# Altium schematic sheet CE842170260_SHEET5.SchDoc
size Tabloid; SheetNumber: 4; SheetTotal: 4; PageSetup: Record=PageOptions|CenterHorizontal=True|CenterVertical=True|PrintScale=0.70|XCorrection=1.00|YCorrection=1.00|PrintKind=1|BorderSize=5000000|LeftOffset=0|BottomOffset=0|Orientation=2|PaperLength=1000|PaperWidth=1000|Scale=100|PaperSource=7|PrintQuality=-4|MediaType=1|DitherType=10|PaperKind=8 1/2x11|PrintScaleMode=1; SPICEModelCacheMIYJXAQF: <root> / <DocumentId>MIYJXAQF</DocumentId> / </root>
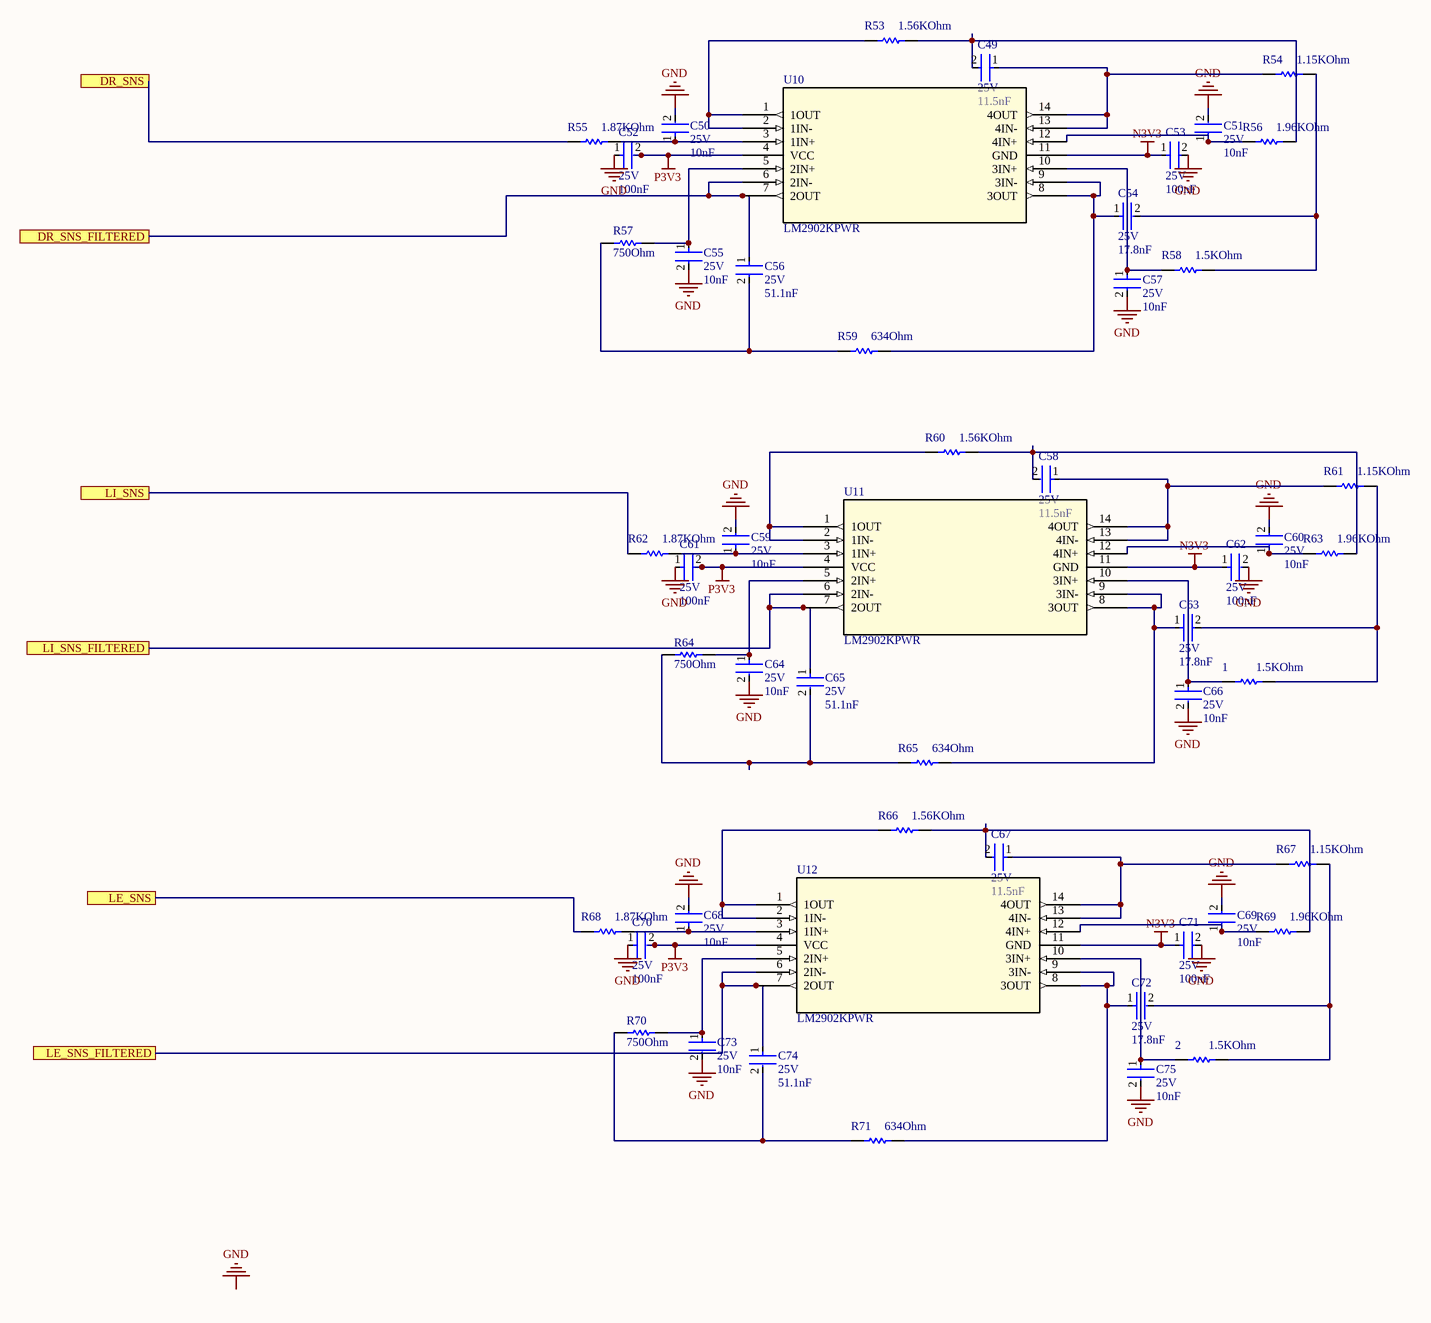
[diagram p0: CE842170260_SHEET5.SchDoc]

## Parts
1  Resistance: 1.5KOhm  [RESC1005X40X25LL05T05]  (hidden comment: ERJ2RKF1002X)
2  Resistance: 1.5KOhm  [RESC1005X40X25LL05T05]  (hidden comment: ERJ2RKF1002X)
C49  Voltage Rating (DC): 25V  Capacitance: 11.5nF  [FP-C1005-050-0_05-MFG]  (hidden comment: C1005X5R1E104K050BC)
C50  Voltage Rating (DC): 25V  Capacitance: 10nF  [FP-C1005-050-0_05-MFG]  (hidden comment: C1005X5R1E104K050BC)
C51  Voltage Rating (DC): 25V  Capacitance: 10nF  [FP-C1005-050-0_05-MFG]  (hidden comment: C1005X5R1E104K050BC)
C52  Voltage Rating (DC): 25V  Capacitance: 100nF  [FP-C1005-050-0_05-MFG]  (hidden comment: C1005X5R1E104K050BC)
C53  Voltage Rating (DC): 25V  Capacitance: 100nF  [FP-C1005-050-0_05-MFG]  (hidden comment: C1005X5R1E104K050BC)
C54  Voltage Rating (DC): 25V  Capacitance: 17.8nF  [FP-C1005-050-0_05-MFG]  (hidden comment: C1005X5R1E104K050BC)
C55  Voltage Rating (DC): 25V  Capacitance: 10nF  [FP-C1005-050-0_05-MFG]  (hidden comment: C1005X5R1E104K050BC)
C56  Voltage Rating (DC): 25V  Capacitance: 51.1nF  [FP-C1005-050-0_05-MFG]  (hidden comment: C1005X5R1E104K050BC)
C57  Voltage Rating (DC): 25V  Capacitance: 10nF  [FP-C1005-050-0_05-MFG]  (hidden comment: C1005X5R1E104K050BC)
C58  Voltage Rating (DC): 25V  Capacitance: 11.5nF  [FP-C1005-050-0_05-MFG]  (hidden comment: C1005X5R1E104K050BC)
C59  Voltage Rating (DC): 25V  Capacitance: 10nF  [FP-C1005-050-0_05-MFG]  (hidden comment: C1005X5R1E104K050BC)
C60  Voltage Rating (DC): 25V  Capacitance: 10nF  [FP-C1005-050-0_05-MFG]  (hidden comment: C1005X5R1E104K050BC)
C61  Voltage Rating (DC): 25V  Capacitance: 100nF  [FP-C1005-050-0_05-MFG]  (hidden comment: C1005X5R1E104K050BC)
C62  Voltage Rating (DC): 25V  Capacitance: 100nF  [FP-C1005-050-0_05-MFG]  (hidden comment: C1005X5R1E104K050BC)
C63  Voltage Rating (DC): 25V  Capacitance: 17.8nF  [FP-C1005-050-0_05-MFG]  (hidden comment: C1005X5R1E104K050BC)
C64  Voltage Rating (DC): 25V  Capacitance: 10nF  [FP-C1005-050-0_05-MFG]  (hidden comment: C1005X5R1E104K050BC)
C65  Voltage Rating (DC): 25V  Capacitance: 51.1nF  [FP-C1005-050-0_05-MFG]  (hidden comment: C1005X5R1E104K050BC)
C66  Voltage Rating (DC): 25V  Capacitance: 10nF  [FP-C1005-050-0_05-MFG]  (hidden comment: C1005X5R1E104K050BC)
C67  Voltage Rating (DC): 25V  Capacitance: 11.5nF  [FP-C1005-050-0_05-MFG]  (hidden comment: C1005X5R1E104K050BC)
C68  Voltage Rating (DC): 25V  Capacitance: 10nF  [FP-C1005-050-0_05-MFG]  (hidden comment: C1005X5R1E104K050BC)
C69  Voltage Rating (DC): 25V  Capacitance: 10nF  [FP-C1005-050-0_05-MFG]  (hidden comment: C1005X5R1E104K050BC)
C70  Voltage Rating (DC): 25V  Capacitance: 100nF  [FP-C1005-050-0_05-MFG]  (hidden comment: C1005X5R1E104K050BC)
C71  Voltage Rating (DC): 25V  Capacitance: 100nF  [FP-C1005-050-0_05-MFG]  (hidden comment: C1005X5R1E104K050BC)
C72  Voltage Rating (DC): 25V  Capacitance: 17.8nF  [FP-C1005-050-0_05-MFG]  (hidden comment: C1005X5R1E104K050BC)
C73  Voltage Rating (DC): 25V  Capacitance: 10nF  [FP-C1005-050-0_05-MFG]  (hidden comment: C1005X5R1E104K050BC)
C74  Voltage Rating (DC): 25V  Capacitance: 51.1nF  [FP-C1005-050-0_05-MFG]  (hidden comment: C1005X5R1E104K050BC)
C75  Voltage Rating (DC): 25V  Capacitance: 10nF  [FP-C1005-050-0_05-MFG]  (hidden comment: C1005X5R1E104K050BC)
R53  Resistance: 1.56KOhm  [RESC1005X40X25LL05T05]  (hidden comment: ERJ2RKF1002X)
R54  Resistance: 1.15KOhm  [RESC1005X40X25LL05T05]  (hidden comment: ERJ2RKF1002X)
R55  Resistance: 1.87KOhm  [RESC1005X40X25LL05T05]  (hidden comment: ERJ2RKF1002X)
R56  Resistance: 1.96KOhm  [RESC1005X40X25LL05T05]  (hidden comment: ERJ2RKF1002X)
R57  Resistance: 750Ohm  [RESC1005X40X25LL05T05]  (hidden comment: ERJ2RKF1002X)
R58  Resistance: 1.5KOhm  [RESC1005X40X25LL05T05]  (hidden comment: ERJ2RKF1002X)
R59  Resistance: 634Ohm  [RESC1005X40X25LL05T05]  (hidden comment: ERJ2RKF1002X)
R60  Resistance: 1.56KOhm  [RESC1005X40X25LL05T05]  (hidden comment: ERJ2RKF1002X)
R61  Resistance: 1.15KOhm  [RESC1005X40X25LL05T05]  (hidden comment: ERJ2RKF1002X)
R62  Resistance: 1.87KOhm  [RESC1005X40X25LL05T05]  (hidden comment: ERJ2RKF1002X)
R63  Resistance: 1.96KOhm  [RESC1005X40X25LL05T05]  (hidden comment: ERJ2RKF1002X)
R64  Resistance: 750Ohm  [RESC1005X40X25LL05T05]  (hidden comment: ERJ2RKF1002X)
R65  Resistance: 634Ohm  [RESC1005X40X25LL05T05]  (hidden comment: ERJ2RKF1002X)
R66  Resistance: 1.56KOhm  [RESC1005X40X25LL05T05]  (hidden comment: ERJ2RKF1002X)
R67  Resistance: 1.15KOhm  [RESC1005X40X25LL05T05]  (hidden comment: ERJ2RKF1002X)
R68  Resistance: 1.87KOhm  [RESC1005X40X25LL05T05]  (hidden comment: ERJ2RKF1002X)
R69  Resistance: 1.96KOhm  [RESC1005X40X25LL05T05]  (hidden comment: ERJ2RKF1002X)
R70  Resistance: 750Ohm  [RESC1005X40X25LL05T05]  (hidden comment: ERJ2RKF1002X)
R71  Resistance: 634Ohm  [RESC1005X40X25LL05T05]  (hidden comment: ERJ2RKF1002X)
U10  LM2902KPWR  [PW14]
U11  LM2902KPWR  [PW14]
U12  LM2902KPWR  [PW14]

## Ports
DR_SNS, DR_SNS_FILTERED, LE_SNS, LE_SNS_FILTERED, LI_SNS, LI_SNS_FILTERED

## Nets
GND: C50.2 C51.2 C52.1 C53.2 C55.2 C57.2 C59.2 C60.2 C61.1 C62.2 C64.2 C66.2 C68.2 C69.2 C70.1 C71.2 C73.2 C75.2
N3V3: C53.1 C62.1 C71.1 U10.11(GND) U11.11(GND) U12.11(GND)
P3V3: C52.2 C61.2 C70.2 U10.4(VCC) U11.4(VCC) U12.4(VCC)
DR_SNS: R55.1 ; port DR_SNS
DR_SNS_FILTERED: C56.1 U10.6(2IN-) U10.7(2OUT) ; port DR_SNS_FILTERED
LE_SNS: R68.1 ; port LE_SNS
LE_SNS_FILTERED: C74.1 U12.6(2IN-) U12.7(2OUT) ; port LE_SNS_FILTERED
LI_SNS: R62.1 ; port LI_SNS
LI_SNS_FILTERED: C65.1 U11.6(2IN-) U11.7(2OUT) ; port LI_SNS_FILTERED
Net1_1: 1.1 C66.1 U11.10(3IN+)
Net1_2: 1.2 C63.2 R61.2
Net2_1: 2.1 C75.1 U12.10(3IN+)
Net2_2: 2.2 C72.2 R67.2
NetC49_1: C49.1 R54.1 U10.13(4IN-) U10.14(4OUT)
NetC49_2: C49.2 R53.2 R56.2
NetC50_1: C50.1 R55.2 U10.3(1IN+)
NetC51_1: C51.1 R56.1 U10.12(4IN+)
NetC54_1: C54.1 R59.2 U10.8(3OUT) U10.9(3IN-)
NetC54_2: C54.2 R54.2 R58.2
NetC55_1: C55.1 R57.1 U10.5(2IN+)
NetC56_2: C56.2 R57.2 R59.1
NetC57_1: C57.1 R58.1 U10.10(3IN+)
NetC58_1: C58.1 R61.1 U11.13(4IN-) U11.14(4OUT)
NetC58_2: C58.2 R60.2 R63.2
NetC59_1: C59.1 R62.2 U11.3(1IN+)
NetC60_1: C60.1 R63.1 U11.12(4IN+)
NetC63_1: C63.1 R65.2 U11.8(3OUT) U11.9(3IN-)
NetC64_1: C64.1 R64.1 U11.5(2IN+)
NetC65_2: C65.2 R64.2 R65.1
NetC67_1: C67.1 R67.1 U12.13(4IN-) U12.14(4OUT)
NetC67_2: C67.2 R66.2 R69.2
NetC68_1: C68.1 R68.2 U12.3(1IN+)
NetC69_1: C69.1 R69.1 U12.12(4IN+)
NetC72_1: C72.1 R71.2 U12.8(3OUT) U12.9(3IN-)
NetC73_1: C73.1 R70.1 U12.5(2IN+)
NetC74_2: C74.2 R70.2 R71.1
NetR53_1: R53.1 U10.1(1OUT) U10.2(1IN-)
NetR60_1: R60.1 U11.1(1OUT) U11.2(1IN-)
NetR66_1: R66.1 U12.1(1OUT) U12.2(1IN-)

## Notes on the sheet
- Labels drawn without touching a wire or pin: GND
- BH CONFIDENTIAL
- NOTE
- Title:
- Sheet Title:
- Designed:
- Checked:
- Date:
- DRAWN IN ACCORDANCE WITH TECHNOLOGY WORK INSTRUCTIONS W064
- REV
- DATE
- ECR/ECN
- INT'L
- Number:
- Approved:
- FOR LIMITED NEED TO KNOW USE ONLY. NO PARTS OF THIS DOCUMENT MAY BE PRODUCED OR DISCLOSED WITHOUT PRIOR PERMISSION OF BH
- File:
- Sheet:
- of

## Library data of the parts
1 2 R53-R71 = CMP-2000-07588-1: Chip Resistor, 10 KOhm, +/- 1%, 0.1 W, -55 to 155 degC, 0402 (1005 Metric), RoHS, Tape and Reel; Manufacturer: Panasonic; Power Rating: 100mW; Voltage Rating: 50V; Case\/Package: 0402; Temperature Coefficient: 100ppm\/degreesC; RoHSCompliant: True; Lead Free: LeadFree; Package Quantity: 1; Contact Plating: Tin; Length: 1mm; Radiation Hardening: No; REACH SVHC: NoSVHC; Max Operating Temperature: 155degC; Depth: 0.5mm; Case Code (Imperial): 0402; Military Standard: Not; Package Description: 2-Pin Surface Mount Device, Body 1 x 0.5 mm; Termination: SMD/SMT; Case Code (Metric): 1005; Height: 0.35mm; Packaging: TapeandReel; Voltage Rating (DC): 50V; Package Reference: 402; Number of Pins: 2; Tolerance: 1%; Mounting Technology: SurfaceMount; Width: 0.02inch; Mount: SurfaceMount; Datasheet URL: https://industrial.panasonic.com/cdbs/www-data/pdf/RDA0000/AOA0000C304.pdf; Composition: ThickFilm; Datasheet Version: 02/2017; Manufacturer URL: http://www.panasonic.com/; Max Power Dissipation: 100mW; Number of Terminations: 2; Min Operating Temperature: -55degC
C49-C75 = CMP-2000-06000-2: Multilayer Ceramic Capacitors 100nF ±10% 25V X5R SMD 0402; Case Code (Imperial): 0402; Termination: Wraparound; Series: C; Depth: 0.5mm; Contact Plating: Tin; Case Code (Metric): 1005; Dielectric: X5R; Case/Package: 0402; Voltage Rating: 25V; Packaging: Tape and Reel; Thickness: 0.022inch; Dielectric Material: Ceramic; Height: 0.5mm; Weight: 2.3E-05oz; RoHS Compliant: Yes; Width: 0.02inch; Tolerance: 10%; Mount: Surface Mount; Package Quantity: 1; Max Operating Temperature: 85°C; Construction: Flat; Min Operating Temperature: -55°C; REACH SVHC: No SVHC; Resistor Type: Ceramic; Length: 1mm; Lead Free: Lead Free; Voltage: 25V
U10-U12 = LM2902KPWR: No Description Available; Mfr_Name: Texas Instruments; Copyright: Copyright (C) 2023 Ultra Librarian. All rights reserved.; Manufacturer_Part_Number: LM2902KPWR; RefDes: RefDes; Type: DEV